# Altium schematic sheet MCP1700T-3302.SchDoc: Converter 2.3 - 6 VDC, 3.3V DC output, 0.25 A
size A4; DrawnBy: Isaque Sá; Organization: CeNTI; Address1: Rua Fernando Mesquita 2785; Address2: Vila Nova de Famalicão; Address3: 4760-034, Portugal; Revision: 0; SheetNumber: 4; SheetTotal: 4; Project: AM2R- Safe2Wheels; ProjectName: Smart Systems - Hardware
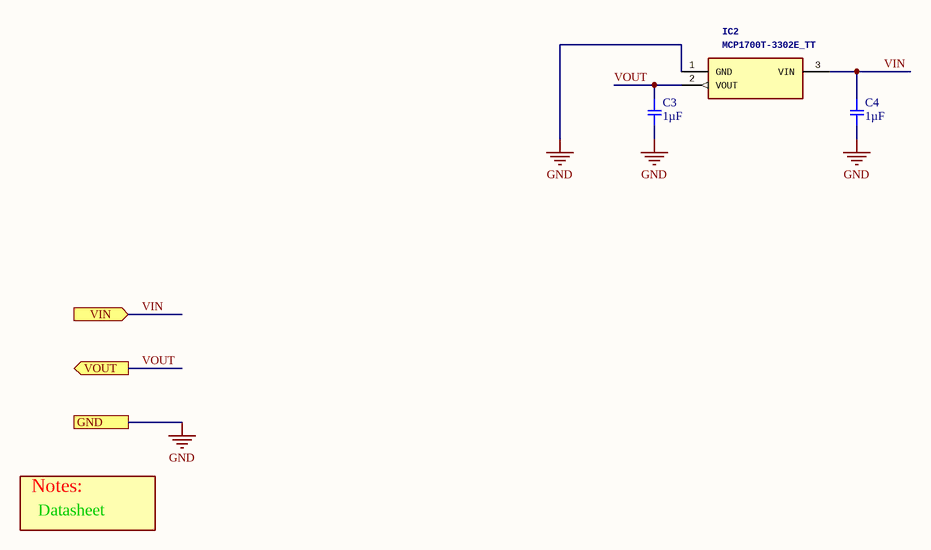
[diagram p0: MCP1700T-3302.SchDoc]

## Parts
C3  1µF  [SMD-0402C]
C4  1µF  [SMD-0402C]
IC2  MCP1700T-3302E_TT  [SOT23]

## Ports
GND, VIN (in), VOUT (out)

## Nets
GND: C3.2 C4.2 IC2.1(GND) ; port GND
VIN: C4.1 IC2.3(VIN) ; port VIN
VOUT: C3.1 IC2.2(VOUT) ; port VOUT

## Notes on the sheet
- Notes:
- Datasheet <https://ww1.microchip.com/downloads/en/DeviceDoc/MCP1700-Low-Quiescent-Current-LDO-20001826E.pdf>
- Title:
- Project:
- Date:
- Rev:
- Sheet
- of
- Author:

## Library data of the parts
C3 C4 = GCM155C71A105KE38D: CAP CER 1UF 10V X7S 0402; Manufacturer: Murata Electronics North America; Factory Stock: 0; Unit Price (USD): 0.12; Minimum Quantity: 1; Tolerance: ±10%; Datasheets: http://www.murata.com/~/media/webrenewal/support/library/catalog/products/capacitor/mlcc/c03e.ashx; Image: //media.digikey.com/Renders/Murata%20Renders/ZRB-SERIES-0402.jpg; Digi-Key Part Number: 490-13409-1-ND; Part Number: GCM155C71A105KE38D; Quantity Available: 7240; @ qty: 0; Packaging: Cut Tape (CT); Series: GCM; Part Status: Active; Value: 1µF; Voltage: 10V; Temperature Coefficient: X7S; Operating Temperature: -55°C ~ 125°C; Features: -; Ratings: AEC-Q200; Applications: Automotive; Mounting Type: Surface Mount, MLCC; Package / Case: 0402 (1005 Metric); Size / Dimension: 0.039" L x 0.020" W (1.00mm x 0.50mm); Height - Seated (Max): -; Thickness (Max): 0.022" (0.55mm); Lead Spacing: -; Lead Style: -
IC2 = MCP1700T-3302: LDO Voltage Regulator 250mA 3.3V; Manufacturer_Name: Microchip; Manufacturer_Part_Number: MCP1700T-3302E/TT; GateName_1: G$1; Allied_Number: 70046119; SymbolName_1: MCP1700T-3302E_TT; LibraryName: MCP1700T-3302E_TT; DeviceSetName: MCP1700T-3302E_TT; Mouser_Part_Number: 579-MCP1700T3302E/TT; Mouser_Price-Stock: https://www.mouser.com/Search/Refine.aspx?Keyword=579-MCP1700T3302E%2FTT; RS_Part_Number: 6989044P; RS_Price-Stock: http://uk.rs-online.com/web/p/products/6989044P; Allied_Price-Stock: http://www.alliedelec.com/microchip-technology-inc-mcp1700t-3302e-tt/70046119/; Height: 1.12mm